# Altium schematic sheet Circuit.SchDoc
size A4; SheetNumber: 1; SheetTotal: 1
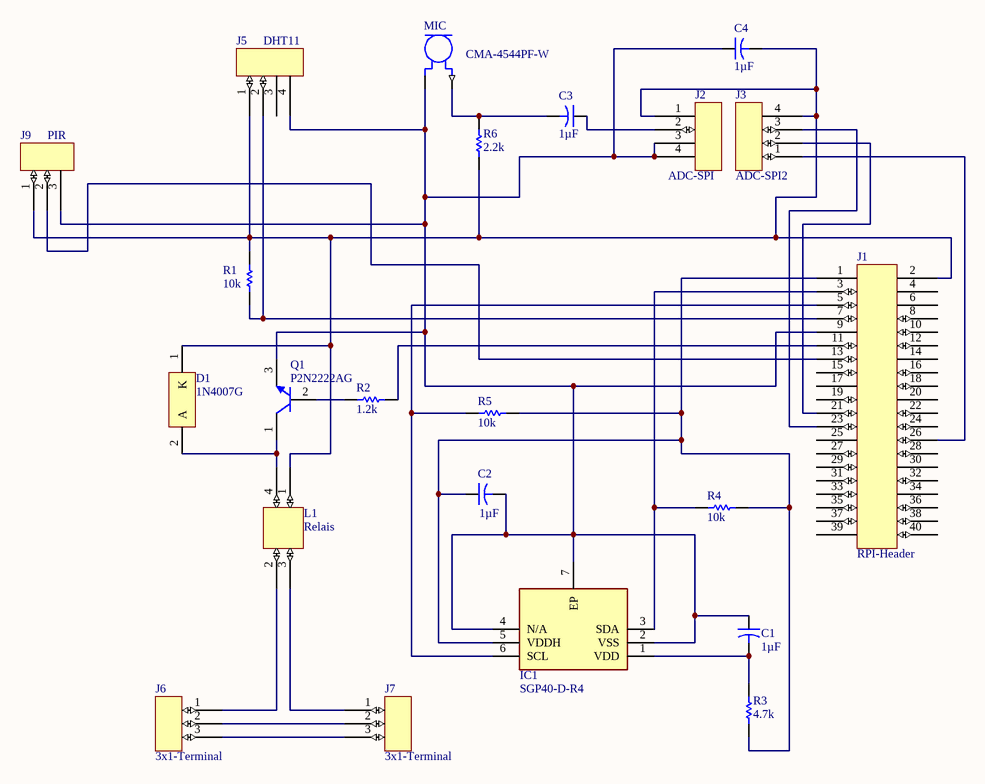
[diagram p0: Circuit.SchDoc]

## Parts
C1  value 1µF  [CAPR5-4X5]
C2  value 1µF  [CAPR5-4X5]  (hidden comment: Cap2)
C3  value 1µF  [CAPR5-4X5]
C4  value 1µF  [CAPR5-4X5]
D1  1N4007G  [ONSC-AXIAL_LEAD-2-59-10_P]
IC1  SGP40-D-R4  [SON80P244X244X95-7N]
J1  RPI-Header  [RPI-Header]
J2  ADC-SPI  [4x1]
J3  ADC-SPI2  [4x1]
J5  DHT11  [4x1]
J6  3x1-Terminal  [3x1-Terminal]
J7  3x1-Terminal  [3x1-Terminal]
J9  PIR  [3x1]
L1  Relais  [Relais]
MIC  CMA-4544PF-W  [MIC_CMA-4544PF-W]
Q1  P2N2222AG  [ONSC-TO-92-3-29-11]
R1  10k  [AXIAL-0.3]
R2  1.2k  [AXIAL-0.3]
R3  4.7k  [AXIAL-0.3]
R4  10k  [AXIAL-0.3]
R5  10k  [AXIAL-0.3]
R6  2.2k  [AXIAL-0.3]

## Nets
NetC1_1: C1.1 C2.2 C4.1 IC1.2(VSS) IC1.4(N/A) IC1.7(EP) J1.9 J2.3 J2.4 J5.4 J9.3 MIC.2(GND) Q1.3(E)
NetC1_2: C1.2 IC1.1(VDD) R3.2
NetC2_1: C2.1 IC1.5(VDDH) J1.1 R3.1 R4.2 R5.2
NetC3_1: C3.1 J2.2
NetC3_2: C3.2 MIC.1(OUT) R6.2
NetC4_2: C4.2 D1.1(K) J1.2 J2.1 J3.4 J5.1 J9.1 L1.1 R1.1 R6.1
NetD1_2: D1.2(A) L1.4 Q1.1(C)
NetIC1_3: IC1.3(SDA) J1.3 R4.1
NetIC1_6: IC1.6(SCL) J1.5 R5.1
NetJ1_7: J1.7 J5.2 R1.2
NetJ1_11: J1.11 R2.2
NetJ1_13: J1.13 J9.2
NetJ1_21: J1.21 J3.2
NetJ1_23: J1.23 J3.3
NetJ1_26: J1.26 J3.1
NetJ6_1: J6.1 L1.2
NetJ6_2: J6.2 J7.2
NetJ6_3: J6.3 J7.3
NetJ7_1: J7.1 L1.3
NetQ1_2: Q1.2(B) R2.1

Not connected (* = marked no-connect by the designer): J1 4 6 8 10 12 14 15 16 17 18 19 20 22 24 25 27 28 29 30 31 32 33 34 35 36 37 38 39 40; J5 3

## Library data of the parts
C1-C4 = Cap2: Capacitor; Published: 23-Sep-2002; PackageReference: CAPR5-4X5; Publisher: Altium Limited; PackageDescription: Capacitor; 2 Leads
D1 = CMP-0902-00143-1: Standard Recovery Rectifier, 2-Pin Axial_Lead, Pb-Free, Bulk Bag; Manufacturer: On Semiconductor; VRRM Max (V): 1000; IFSM Max (A): 30; IO(rec) Max (A): 1; ComponentLink2Description: Datasheet; ComponentLink2URL: http://www.onsemi.com/pub_link/Collateral/1N4001-D.PDF; PackageDescription: 2-Pin, Axial Lead, Diameter 2.35 mm; PartNumber: 1N4007G; ComponentLink1URL: http://www.onsemi.com/; ComponentLink3URL: http://www.onsemi.cn/pub_link/Collateral/59-10.PDF; PackageReference: AXIAL_LEAD-2-59-10; ComponentLink1Description: Manufacturer URL; Mounting Technology: Through Hole; ComponentLink3Description: Package Specification; Packing: Bulk Bag; PackageVersion: Rev. U, 02/2005; DatasheetVersion: Rev. 13; RoHS: TRUE; Type: Standard Recovery
IC1 = SGP40-D-R4: Integrated Circuit; Manufacturer_Name: Sensirion; Datasheet Link: https://www.mouser.com/datasheet/2/682/Sensirion_Gas_Sensors_SGP40_Datasheet-1888696.pdf; Height: 0.95mm; Manufacturer_Part_Number: SGP40-D-R4; Mouser Part Number: 403-SGP40-D-R4; Mouser Price/Stock: https://www.mouser.co.uk/ProductDetail/Sensirion/SGP40-D-R4?qs=yqaQSyyJnNgaRqiZfsbS1Q%3D%3D; Arrow Part Number: SGP40-D-R4; Arrow Price/Stock: https://www.arrow.com/en/products/sgp40-d-r4/sensirion-ag?region=nac
J2 J3 J5 = 4x1
J9 = 3x1
MIC = CMA-4544PF-W: CMA Series 9.7 mm Electret Condenser Omni-Directional Pin Mount 3 V Microphone; Package: None; Availability: Unavailable; Value: *; MP: CMA-4544PF-W; Price: None
Q1 = CMP-1048-01402-1: Amplifier Transistor, NPN Silicon, 3-Pin TO-92, Pb-Free, Bulk Box; Manufacturer: On Semiconductor; IC Continuous (A): 0.6; fT Min (MHz): 300; ComponentLink2Description: Datasheet; ComponentLink1Description: Manufacturer URL; ComponentLink2URL: http://www.onsemi.com/pub_link/Collateral/P2N2222A-D.PDF; ComponentLink3Description: Package Specification; RoHS: TRUE; ComponentLink1URL: http://www.onsemi.com/; PartNumber: P2N2222AG; Mounting Technology: Through Hole; PackageReference: TO-92-3-29-11_AM_SL; Polarity: NPN; Packing: Bulk Box; DatasheetVersion: Rev. 7; PackageDescription: 3-Pin Transistor Outline, Body 4.825 x 3.685 mm, Pitch 1.27 mm; PackageVersion: Rev. AM; ComponentLink3URL: http://www.onsemi.cn/pub_link/Collateral/2N6426-D.PDF
R1-R6 = Res1: Resistor; Value: 1K; Published: 8-Jun-2000; LatestRevisionDate: 17-Jul-2002; LatestRevisionNote: Re-released for DXP Platform.; PackageReference: AXIAL-0.3; Publisher: Altium Limited; PackageDescription: Axial Device, Thru-Hole; 2 Leads; 0.3 in Pin Spacing